# EAGLE design MaxStream Radio BoardV4_07_01_13 (EAGLE 5.11)
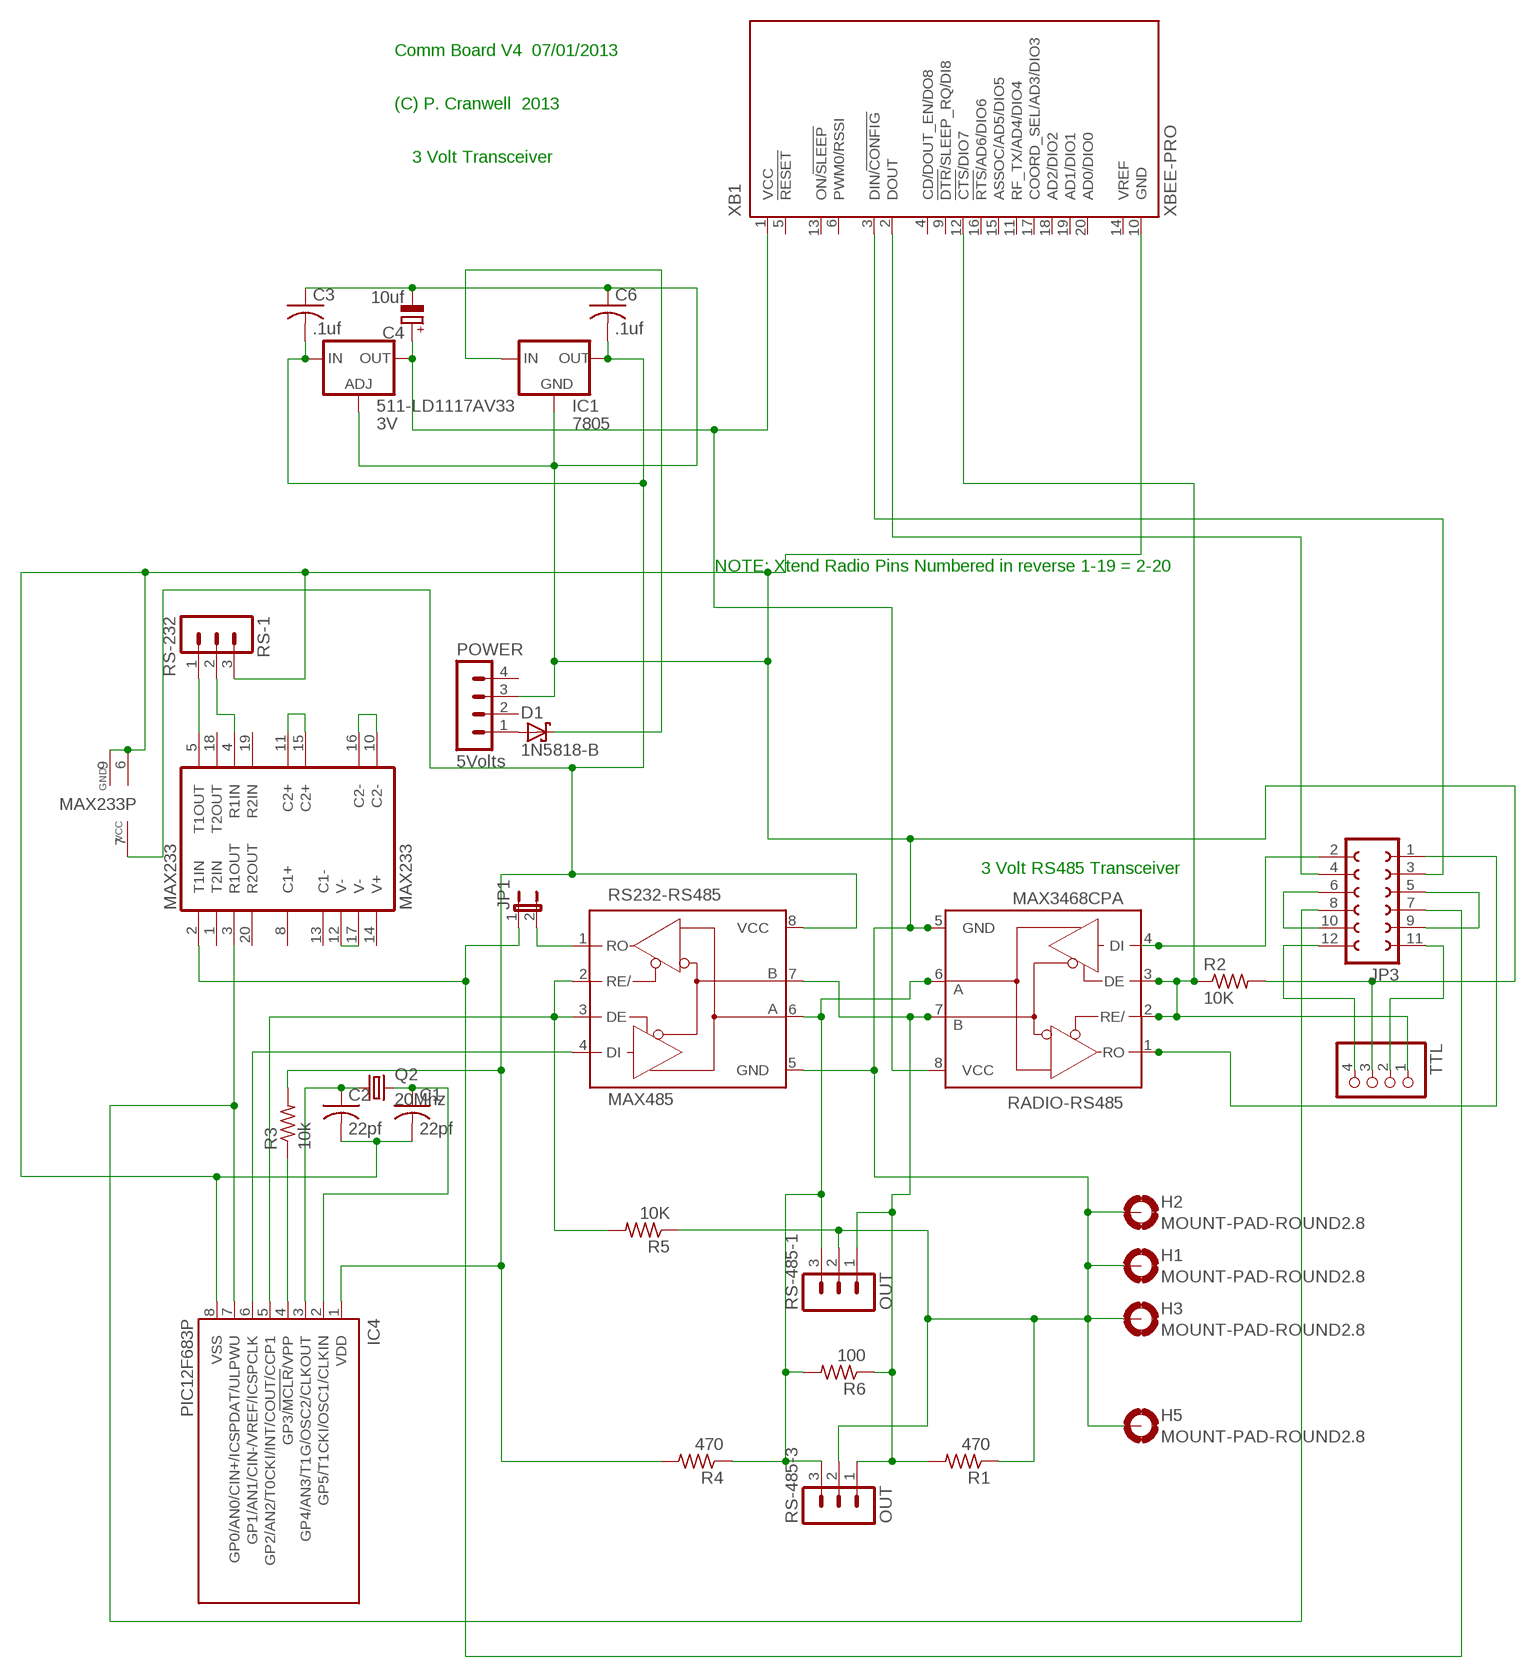
[diagram p0: schematic, sheet 1]

## Parts
511-LD1117AV33  3V  LD117AV33  [TO220L1]
C1  22pf  C-US025-024X044  [C025-024X044]
C2  22pf  C-US025-024X044  [C025-024X044]
C3  .1uf  C-US025-024X044  [C025-024X044]
C4  10uf  CPOL-EUE1.8-4  [E1,8-4]
C6  .1uf  C-US025-024X044  [C025-024X044]
D1  1N5818-B  [DO41-7.6]
H1  MOUNT-PAD-ROUND2.8  [2,8-PAD]
H2  MOUNT-PAD-ROUND2.8  [2,8-PAD]
H3  MOUNT-PAD-ROUND2.8  [2,8-PAD]
H5  MOUNT-PAD-ROUND2.8  [2,8-PAD]
IC1  7805  78XXL  [78XXL]
IC4  PIC12F683P  [DIL8]
JP1  JP1E  [JP1]
JP3  FE06-2  [FE06-2]
MAX233  MAX233  [DIL20]
POWER  5Volts  MA04-1  [MA04-1]
Q2  20Mhz  CRYSTALHC49S  [HC49/S]
R1  470  R-US_0204/7  [0204/7]
R2  10K  R-US_0204/7  [0204/7]
R3  10k  R-US_0204/7  [0204/7]
R4  470  R-US_0204/7  [0204/7]
R5  10K  R-US_0204/7  [0204/7]
R6  100  R-US_0204/7  [0204/7]
RADIO-RS485  MAX3468CPA  [DIL08]
RS232-RS485  MAX485  MAX3468CPA  [DIL08]
RS-1  RS-232  MA03-1  [MA03-1]
RS-485-1  OUT  MA03-1  [MA03-1]
RS-485-3  OUT  MA03-1  [MA03-1]
TTL  PINHD-1X4  [1X04]
XB1  XBEE-PRO  [XBEE-PRO]

## Nets
3V: 511-LD1117AV33.2(OUT) C4.+ RADIO-RS485.8(VCC) XB1.1(VCC)
N$1: IC4.7(GP0/AN0/CIN+/ICSPDAT/ULPWU) JP3.8 MAX233.3(R1OUT)
N$2: R2.1 RADIO-RS485.2(RE/) RADIO-RS485.3(DE) TTL.1 XB1.12(!CTS!/DIO7)
N$4: MAX233.5(T1OUT) RS-1.1
N$5: R4.1 R6.2 RADIO-RS485.6(A) RS232-RS485.6(A) RS-485-1.3 RS-485-3.3
N$6: C1.1 IC4.2(GP5/T1CKI/OSC1/CLKIN) Q2.2
N$7: MAX233.11(C2+) MAX233.15(C2+)
N$8: MAX233.10(C2-) MAX233.16(C2-)
N$9: MAX233.12(V-) MAX233.17(V-)
N$10: JP3.3 XB1.3(DIN/!CONFIG)
N$11: MAX233.4(R1IN) RS-1.2
N$12: IC4.5(GP2/AN2/T0CKI/INT/COUT/CCP1) R5.2 RS232-RS485.2(RE/) RS232-RS485.3(DE)
N$13: JP1.2 RS232-RS485.1(RO)
N$14: JP3.4 XB1.2(DOUT)
N$16: D1.A POWER.1
N$17: IC4.6(GP1/AN1/CIN-/VREF/ICSPCLK) RS232-RS485.4(DI)
N$18: R1.2 R6.1 RADIO-RS485.7(B) RS232-RS485.7(B) RS-485-1.1 RS-485-3.1
N$19: IC4.4(GP3/!MCLR!/VPP) R3.1
N$20: C2.1 IC4.3(GP4/AN3/T1G/OSC2/CLKOUT) Q2.1
N$21: JP3.2 RADIO-RS485.4(DI)
N$23: JP3.1 RADIO-RS485.1(RO)
N$24: JP1.1 JP3.7 MAX233.2(T1IN)
N$26: JP3.5 JP3.9
N$27: JP3.6 JP3.10
N$28: JP3.12 TTL.4
N$30: D1.C IC1.IN
TTL: JP3.11 TTL.2
VDD: 511-LD1117AV33.3(IN) C3.2 C6.2 IC1.OUT IC4.1(VDD) MAX233.7(VCC) R3.2 R4.2 RS232-RS485.8(VCC)
VSS [VSS]: 511-LD1117AV33.1(ADJ) C1.2 C2.2 C3.1 C4.- C6.1 H1.B2,8(MOUNT) H2.B2,8(MOUNT) H3.B2,8(MOUNT) H5.B2,8(MOUNT) IC1.GND IC4.8(VSS) MAX233.6(GND) MAX233.9(GND) POWER.3 R1.1 R2.2 R5.1 RADIO-RS485.5(GND) RS232-RS485.5(GND) RS-1.3 RS-485-1.2 RS-485-3.2 TTL.3 XB1.10(GND)
Unconnected: MAX233.1(T2IN) MAX233.8(C1+) MAX233.13(C1-) MAX233.14(V+) MAX233.18(T2OUT) MAX233.19(R2IN) MAX233.20(R2OUT) POWER.2 POWER.4 XB1.4(CD/DOUT_EN/DO8) XB1.5(!RESET) XB1.6(PWM0/RSSI) XB1.9(!DTR!/SLEEP_RQ/DI8) XB1.11(RF_TX/AD4/DIO4) XB1.13(ON/!SLEEP) XB1.14(VREF) XB1.15(ASSOC/AD5/DIO5) XB1.16(!RTS!/AD6/DIO6) XB1.17(COORD_SEL/AD3/DIO3) XB1.18(AD2/DIO2) XB1.19(AD1/DIO1) XB1.20(AD0/DIO0)

## Notes on the sheet
- Comm Board V4  07/01/2013
- (C) P. Cranwell  2013
- 3 Volt Transceiver
- NOTE: Xtend Radio Pins Numbered in reverse 1-19 = 2-20
- 3 Volt RS485 Transceiver

## Library data of the parts
511-LD1117AV33 = v-reg:LD117A?*: Low drop fixed and adjustable positive voltage regulators 1 A Source: http://www.st.com/stonline/products/literature/ds/7194/ld1117axx.pdf
C1-C3 C6 = rcl:C-US: CAPACITOR, American symbol
C4 = rcl:CPOL-EU: POLARIZED CAPACITOR, European symbol
D1 = diode:1N581*: 1.0A SCHOTTKY BARRIER RECTIFIER Source: http://www.diodes.com/datasheets/ds23001.pdf
H1-H3 H5 = holes:MOUNT-PAD-ROUND: MOUNTING PAD, round
IC1 = v-reg:78XXL: VOLTAGE REGULATOR
IC4 = microchip:PIC12F683: 8-Pin Flash-Based, 8-Bit CMOS Microcontrollers with nanoWatt Technology Source: http://ww1.microchip.com/downloads/en/DeviceDoc/41211D_.pdf
JP1 = jumper:JP1E: JUMPER
JP3 = con-lsta:FE06-2: FEMALE HEADER
MAX233 = maxim:MAX233: RS232 TRANSEIVER
POWER = con-lstb:MA04-1: PIN HEADER
Q2 = crystal:CRYSTAL: CRYSTAL
R1-R6 = rcl:R-US_: RESISTOR, American symbol
RADIO-RS485 RS232-RS485 = maxim:MAX34*: +5V, Fail-Safe, 40Mbps, Profibus RS-485/RS-422 Transceivers Source: MAX3465-MAX3469.pdf
RS-1 RS-485-1 RS-485-3 = con-lstb:MA03-1: PIN HEADER
TTL = pinhead:PINHD-1X4: PIN HEADER
XB1 = maxstream:XBEE: XBee (TM) /XBee-PRO(TM) OEM RF Modules Source: MaxStream, Inc. xbee_productmanual.pdf

## Net classes
1 VSS: width 0.61 mm, clearance 0.203 mm

## Board
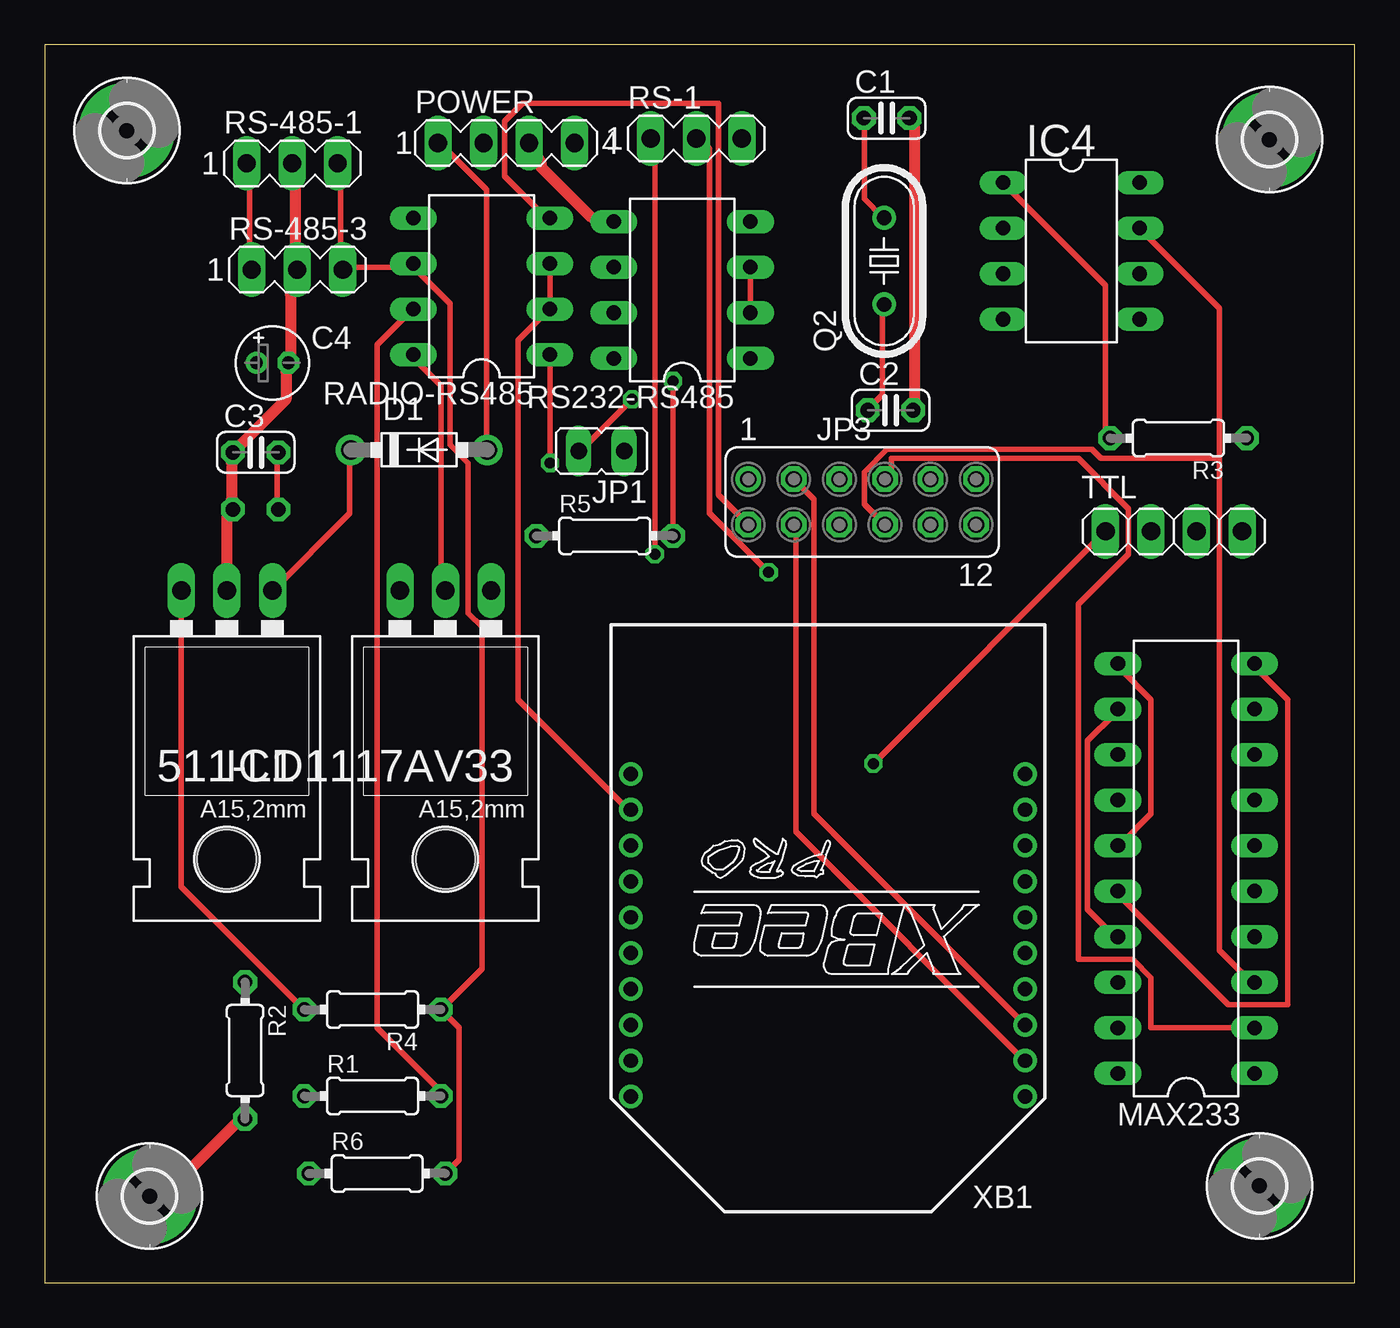
[diagram p1: board, top side]
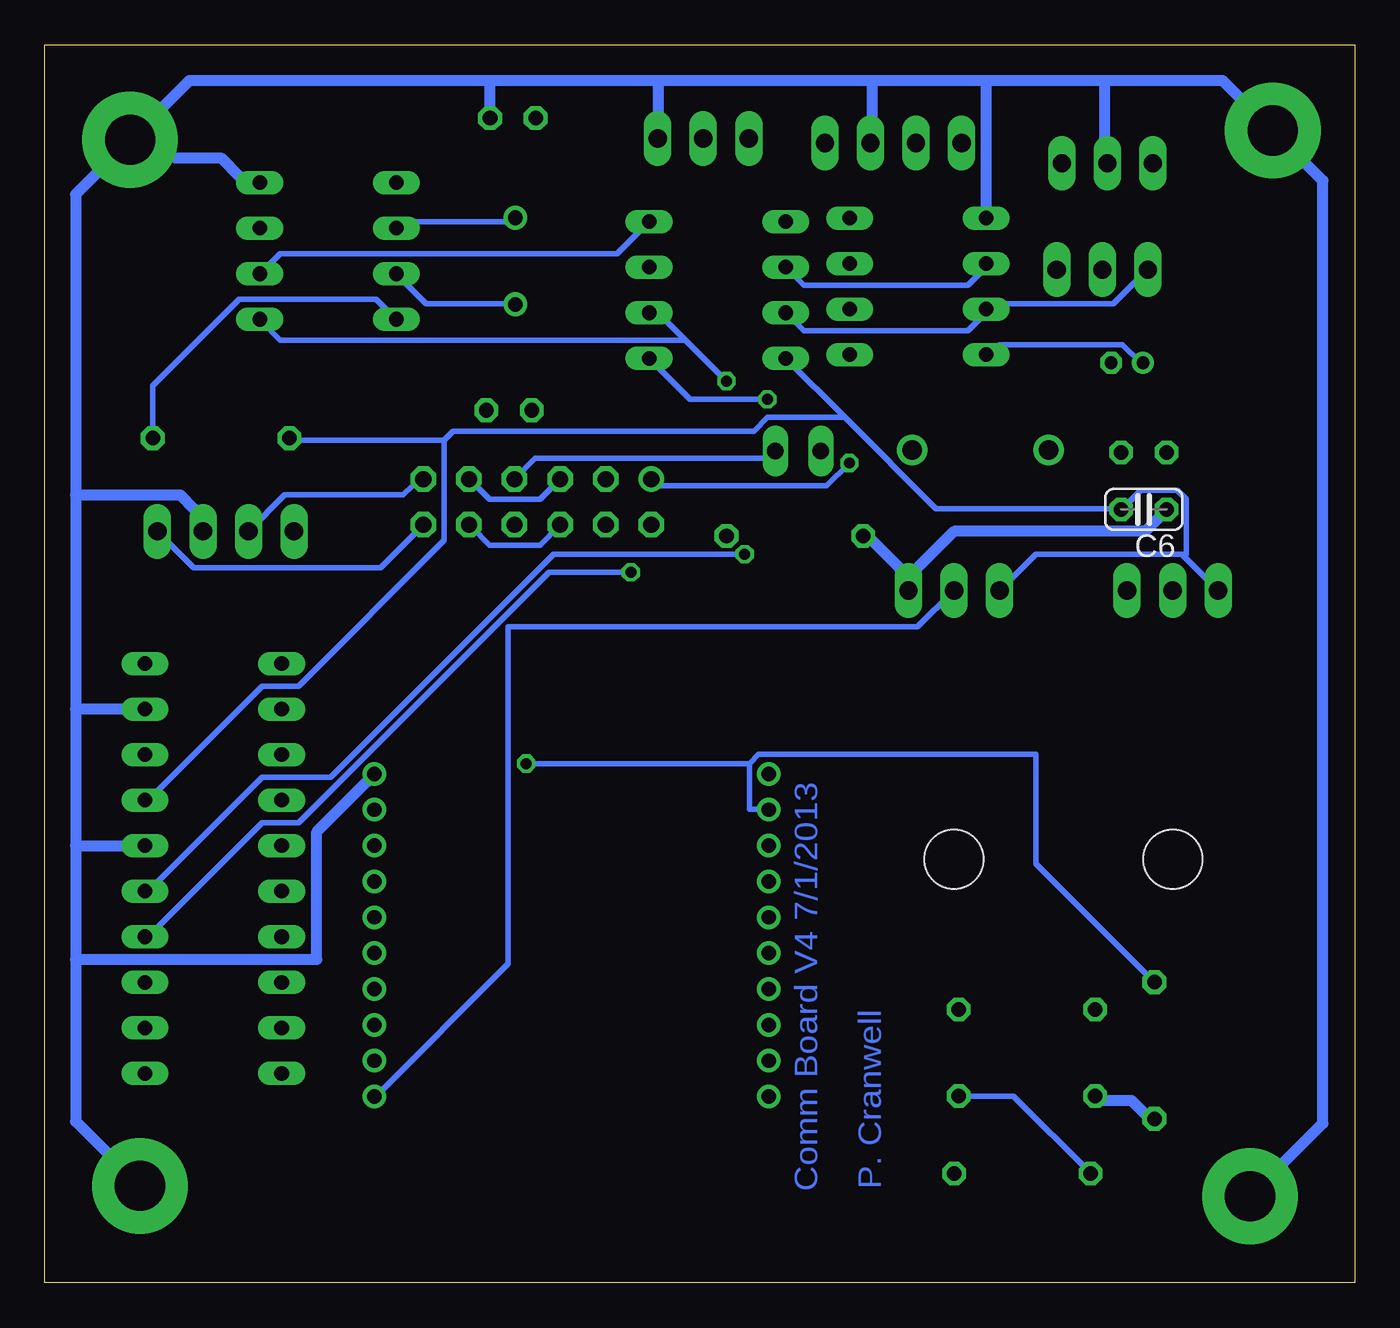
[diagram p2: board, bottom side, seen from below]

Size 73.09 x 69.05 mm. Coordinates in mm from the lower left corner, seen from the top.
Outline: 73.09,0 73.09,69.05 0,69.05 0,0 73.09,0
Copper layers (1*16): Top 0.035mm / dielectric 1.5mm / Bottom 0.035mm
Design rules "default *": minimum track width 12mil, minimum drill 24mil, track to track 8mil, track to pad 8mil, pad to pad 8mil, via to via 8mil, smd to smd 8mil, copper to edge 0mil, drill to drill 8mil, minimum pad ring 10mil, minimum via ring 8mil, stop-mask expansion 4mil, vias tented up to drill 0mil, thermal gap 10mil

### Footprints (pad centres in the part's own frame; a part is rotated, then mirrored left to right if it is on the bottom)
TO220L1 = drill 1.016 long: 1 -2.54,-3.81; 2 0,-3.81; 3 2.54,-3.81 | hole 3.302: 0,11.176
C025-024X044 = drill 0.813 octagon: 1 -1.27,0; 2 1.27,0
E1,8-4 = drill 0.711 pad 1.168 round: + -0.889,0 | drill 0.711 pad 1.168 octagon: - 0.889,0
DO41-7.6 = drill 1.1 pad 1.7 round: A 3.81,0; C -3.81,0
2,8-PAD = drill 2.8 pad 5.334 round: B2,8 0,0
78XXL = drill 1.016 long: GND 0,-3.81; IN -2.54,-3.81; OUT 2.54,-3.81 | hole 3.302: 0,11.176
DIL8 = drill 0.813 long: 1 -3.81,-3.81; 2 -1.27,-3.81; 3 1.27,-3.81; 4 3.81,-3.81; 5 3.81,3.81; 6 1.27,3.81; 7 -1.27,3.81; 8 -3.81,3.81
JP1 = drill 0.914 long: 1 0,-1.27; 2 0,1.27
FE06-2 = drill 0.914 round: 1 -6.35,1.27 | drill 0.914 octagon: 2 -6.35,-1.27; 3 -3.81,1.27; 4 -3.81,-1.27; 5 -1.27,1.27; 6 -1.27,-1.27; 7 1.27,1.27; 8 1.27,-1.27; 9 3.81,1.27; 10 3.81,-1.27; 11 6.35,1.27; 12 6.35,-1.27
DIL20 = drill 0.813 long: 1 -11.43,-3.81; 2 -8.89,-3.81; 3 -6.35,-3.81; 4 -3.81,-3.81; 5 -1.27,-3.81; 6 1.27,-3.81; 7 3.81,-3.81; 8 6.35,-3.81; 9 8.89,-3.81; 10 11.43,-3.81; 11 11.43,3.81; 12 8.89,3.81; 13 6.35,3.81; 14 3.81,3.81; 15 1.27,3.81; 16 -1.27,3.81; 17 -3.81,3.81; 18 -6.35,3.81; 19 -8.89,3.81; 20 -11.43,3.81
MA04-1 = drill 1.016 long: 1 -3.81,0; 2 -1.27,0; 3 1.27,0; 4 3.81,0
HC49/S = drill 0.813 round: 1 -2.413,0; 2 2.413,0
0204/7 = drill 0.813 octagon: 1 -3.81,0; 2 3.81,0
DIL08 = drill 0.813 long: 1 -3.81,-3.81; 2 -1.27,-3.81; 3 1.27,-3.81; 4 3.81,-3.81; 5 3.81,3.81; 6 1.27,3.81; 7 -1.27,3.81; 8 -3.81,3.81
MA03-1 = drill 1.016 long: 1 -2.54,0; 2 0,0; 3 2.54,0
1X04 = drill 1.016 long: 1 -3.81,0; 2 -1.27,0; 3 1.27,0; 4 3.81,0
XBEE-PRO = drill 0.8 pad 1.27 round: 1 -11,9; 2 -11,7; 3 -11,5; 4 -11,3; 5 -11,1; 6 -11,-1; 7 -11,-3; 8 -11,-5; 9 -11,-7; 10 -11,-9; 11 11,-9; 12 11,-7; 13 11,-5; 14 11,-3; 15 11,-1; 16 11,1; 17 11,3; 18 11,5; 19 11,7; 20 11,9

### Placement (x,y rotation side)
511-LD1117AV33  22.35,34.8 180 top
C1  46.97,64.96 0 top
C2  47.19,48.67 0 top
C3  11.77,46.32 0 top
C4  12.7,51.31 0 top
C6  11.76,43.13 180 bottom
D1  20.89,46.45 0 top
H1  4.57,64.26 0 top
H2  67.78,5.4 0 top
H3  68.33,63.75 0 top
H5  5.84,4.83 0 top
IC1  10.16,34.8 180 top
IC4  57.29,57.55 270 top
JP1  31.06,46.4 90 top
JP3  45.61,43.55 0 top
MAX233  63.68,23.11 90 top
POWER  25.74,63.58 0 top
Q2  46.83,56.99 90 top
R1  18.29,10.41 0 top
R2  11.18,12.95 270 top
R3  63.25,47.11 180 top
R4  18.29,15.24 180 top
R5  31.24,41.66 0 top
R6  18.54,6.1 0 top
RADIO-RS485  24.37,55.58 90 top
RS232-RS485  35.56,55.37 90 top
RS-1  36.35,63.82 0 top
RS-485-1  13.81,62.44 0 top
RS-485-3  14.09,56.51 0 top
TTL  62.99,41.91 0 top
XB1  43.7,19.38 180 top

### Tracks (layer width: path | path; a pad name or v marks a point on that pad's centre or on a via)
3V
  Top 0.305: 511-LD1117AV33.2 22.1,38.86 22.1,50.04 20.57,51.56 RADIO-RS485.8
  Bottom 0.305: C4.+ 11.94,51.31 12.95,52.32 19.81,52.32 20.32,51.82 RADIO-RS485.8 | 511-LD1117AV33.2 24.38,36.58 47.24,36.58 47.24,17.78 54.61,10.41 XB1.1
N$1
  Top 0.305: 65.53,45.97 65.53,54.36 61.21,58.67 IC4.7 | 65.53,45.97 65.53,18.54 67.31,16.76 MAX233.3 | 65.53,45.97 58.93,45.97 58.42,46.48 46.99,46.48 45.72,45.21 45.72,43.43 JP3.8
N$2  (via drill 0.61)
  Top 0.305: XB1.12 32.51,26.42 26.42,32.51 26.42,52.58 27.94,54.1 RADIO-RS485.2 28.19,54.36 28.19,56.64 RADIO-RS485.3 | v46.23,28.96 TTL.1
  Bottom 0.305: R2.1 17.78,23.37 17.78,29.46 33.27,29.46 33.78,28.96 | 33.78,28.96 33.78,26.42 32.77,26.42 XB1.12 | 33.78,28.96 v46.23,28.96
N$4  (via drill 0.61)
  Top 0.305: v34.04,40.64 34.04,63.75 RS-1.1
  Bottom 0.305: v34.04,40.64 44.7,40.64 57.15,28.19 60.96,28.19 67.31,21.84 MAX233.5
N$5
  Top 0.305: R6.2 23.11,6.86 23.11,14.22 R4.1 24.38,17.53 24.38,36.58 23.62,37.34 23.62,45.72 22.61,46.74 22.61,54.61 20.57,56.64 RADIO-RS485.6 20.32,56.64 16.76,56.64 RS-485-3.3 16.51,56.64 16.51,62.23 RS-485-1.3
  Bottom 0.305: RS232-RS485.6 30.73,55.63 21.59,55.63 20.57,56.64 RADIO-RS485.6
N$6
  Top 0.305: Q2.2 46.74,59.44 45.72,60.45 45.72,64.77 C1.1
  Bottom 0.305: IC4.2 53.34,58.93 53.09,59.18 46.99,59.18 Q2.2
N$7
  Top 0.305: MAX233.15 59.94,24.38 61.72,26.16 61.72,32.51 59.94,34.29 MAX233.11
N$8
  Top 0.305: MAX233.16 59.94,21.59 66.04,15.49 69.34,15.49 69.34,32.51 67.56,34.29 MAX233.10
N$9
  Top 0.305: MAX233.17 59.69,19.3 58.17,20.83 58.17,30.23 59.69,31.75 MAX233.12
N$10
  Top 0.305: XB1.3 54.61,14.48 42.93,26.16 42.93,43.69 JP3.3
N$11  (via drill 0.61)
  Top 0.305: v40.39,39.62 37.08,42.93 37.08,63.25 36.58,63.75 RS-1.2
  Bottom 0.305: v40.39,39.62 44.96,39.62 58.93,25.65 60.96,25.65 67.31,19.3 MAX233.4
N$12  (via drill 0.61)
  Top 0.305: R5.2 v35.05,50.29 | RS232-RS485.2 RS232-RS485.3
  Bottom 0.305: 37.34,52.58 38.86,54.1 RS232-RS485.2 | v35.05,50.29 37.34,52.58 | 37.34,52.58 59.94,52.58 60.96,53.59 IC4.5
N$13  (via drill 0.61)
  Top 0.305: v32.77,49.28 29.97,46.48 JP1.2
  Bottom 0.305: RS232-RS485.1 37.08,49.28 v32.77,49.28
N$14
  Top 0.305: XB1.2 54.61,12.45 41.91,25.15 41.91,42.16 JP3.4
N$16
  Top 0.305: POWER.1 22.1,63.5 24.64,60.96 24.64,46.48 D1.A
N$17
  Bottom 0.305: RS232-RS485.4 41.15,57.4 59.94,57.4 60.96,56.39 IC4.6
N$18
  Top 0.305: RS-485-1.1 11.43,62.23 11.43,56.64 RS-485-3.1 | R1.2 21.84,10.92 18.54,14.22 18.54,52.32 20.32,54.1 RADIO-RS485.7
  Bottom 0.305: R6.1 19.05,10.41 R1.2 | RS-485-3.1 11.68,56.39 13.46,54.61 20.07,54.61 20.32,54.36 RADIO-RS485.7 20.57,54.1 21.59,53.09 30.73,53.09 RS232-RS485.7
N$19
  Bottom 0.305: IC4.4 53.59,53.85 54.61,54.86 62.23,54.86 67.06,50.04 67.06,47.24 R3.1
N$20
  Top 0.305: C2.1 45.97,48.77 46.74,49.53 46.74,54.36 Q2.1
  Bottom 0.305: IC4.3 53.34,56.13 51.82,54.61 46.99,54.61 Q2.1
N$21
  Top 0.305: RADIO-RS485.4 27.94,59.44 25.65,61.72 25.65,64.77 26.67,65.79 37.59,65.79 37.59,43.94 JP3.2
N$23  (via drill 0.61)
  Top 0.305: v28.19,45.72 28.19,51.56 RADIO-RS485.1
  Bottom 0.305: v28.19,45.72 29.46,44.45 38.86,44.45 39.12,44.7 JP3.1
N$24
  Top 0.305: MAX233.2 67.31,14.22 61.72,14.22 61.72,17.02 60.71,18.03 57.66,18.03 57.66,37.85 60.45,40.64 60.45,43.18 57.66,45.97 47.24,45.97 47.24,45.21 46.99,44.96 JP3.7
  Bottom 0.305: JP1.1 32.51,46.23 32.77,45.97 45.72,45.97 JP3.7
N$26
  Bottom 0.305: JP3.5 45.47,43.69 48.26,43.69 49.28,44.7 JP3.9
N$27
  Bottom 0.305: JP3.6 45.47,41.15 48.26,41.15 49.28,42.16 JP3.10
N$28
  Bottom 0.305: TTL.4 64.77,39.88 54.36,39.88 JP3.12
N$30
  Top 0.305: IC1.IN 17.02,42.93 17.02,46.23 D1.C
TTL
  Bottom 0.305: TTL.2 59.69,43.94 53.09,43.94 52.58,44.45 JP3.11
VDD
  Top 0.305: IC4.1 53.59,61.21 59.18,55.63 59.18,47.5 59.44,47.24 R3.2 | C6.2 12.95,43.18 12.95,46.23 C3.2 | R4.2 7.62,22.1 IC1.OUT
  Bottom 0.305: 50.8,46.99 50.8,41.4 58.93,33.27 60.96,33.27 67.31,26.92 MAX233.7 | 50.8,46.99 59.44,46.99 R3.2 | 28.45,48.26 23.37,43.18 13.21,43.18 C6.2 12.95,43.18 11.94,44.2 9.91,44.2 9.4,43.69 9.4,40.64 9.65,40.64 | 28.45,48.26 RS232-RS485.8 | 511-LD1117AV33.3 17.78,40.64 9.65,40.64 | IC1.OUT 9.65,40.64 | 50.8,46.99 50.29,47.5 33.53,47.5 32.77,48.26 28.45,48.26
VSS
  Top 0.61: IC1.GND 10.16,42.67 C6.1 10.41,43.69 10.41,45.72 C3.1 10.92,46.74 13.46,49.28 13.46,50.8 C4.- 13.72,51.82 13.72,55.12 RS-485-3.2 13.97,57.91 13.97,60.96 RS-485-1.2 | RS232-RS485.5 30.48,59.44 27.69,62.23 27.69,62.48 POWER.3 | C2.2 48.51,49.28 48.51,64.52 C1.2 | R2.2 10.67,8.89 8.13,6.35 8.13,6.1 H5.B2,8
  Bottom 0.61: H5.B2,8 1.78,8.89 1.78,61.47 H1.B2,8 7.37,67.06 13.97,67.06 | 13.97,67.06 20.57,67.06 | 20.57,67.06 26.92,67.06 | 26.92,67.06 38.86,67.06 | 38.86,67.06 48.26,67.06 | 48.26,67.06 65.02,67.06 H3.B2,8 | H3.B2,8 71.37,60.71 71.37,43.94 | 71.37,43.94 71.37,32 | 71.37,32 71.37,24.38 | 71.37,24.38 71.37,18.03 | 71.37,18.03 71.37,9 H2.B2,8 | R5.1 26.92,41.4 25.4,39.88 511-LD1117AV33.1 24.38,39.88 22.35,41.91 11.68,41.91 10.92,42.67 C6.1 | R2.2 11.68,9.4 12.45,10.16 13.97,10.16 R1.1 | XB1.10 55.12,27.94 57.91,25.15 57.91,18.03 71.37,18.03 | MAX233.6 68.58,24.38 71.37,24.38 | MAX233.9 68.58,32 71.37,32 | RADIO-RS485.5 20.57,59.94 20.57,67.06 | C1.2 48.26,65.53 48.26,67.06 | IC4.8 62.23,61.72 63.25,62.74 65.79,62.74 H3.B2,8 | RS-485-1.2 13.97,63.75 13.97,67.06 | RS-1.3 38.86,65.28 38.86,67.06 | TTL.3 64.77,43.18 65.53,43.94 71.37,43.94 | POWER.3 26.92,65.02 26.92,67.06

### Text on the board
Bottom: Comm Board V4 7/1/2013 | P. Cranwell